# Altium project PCB3.PrjPCB
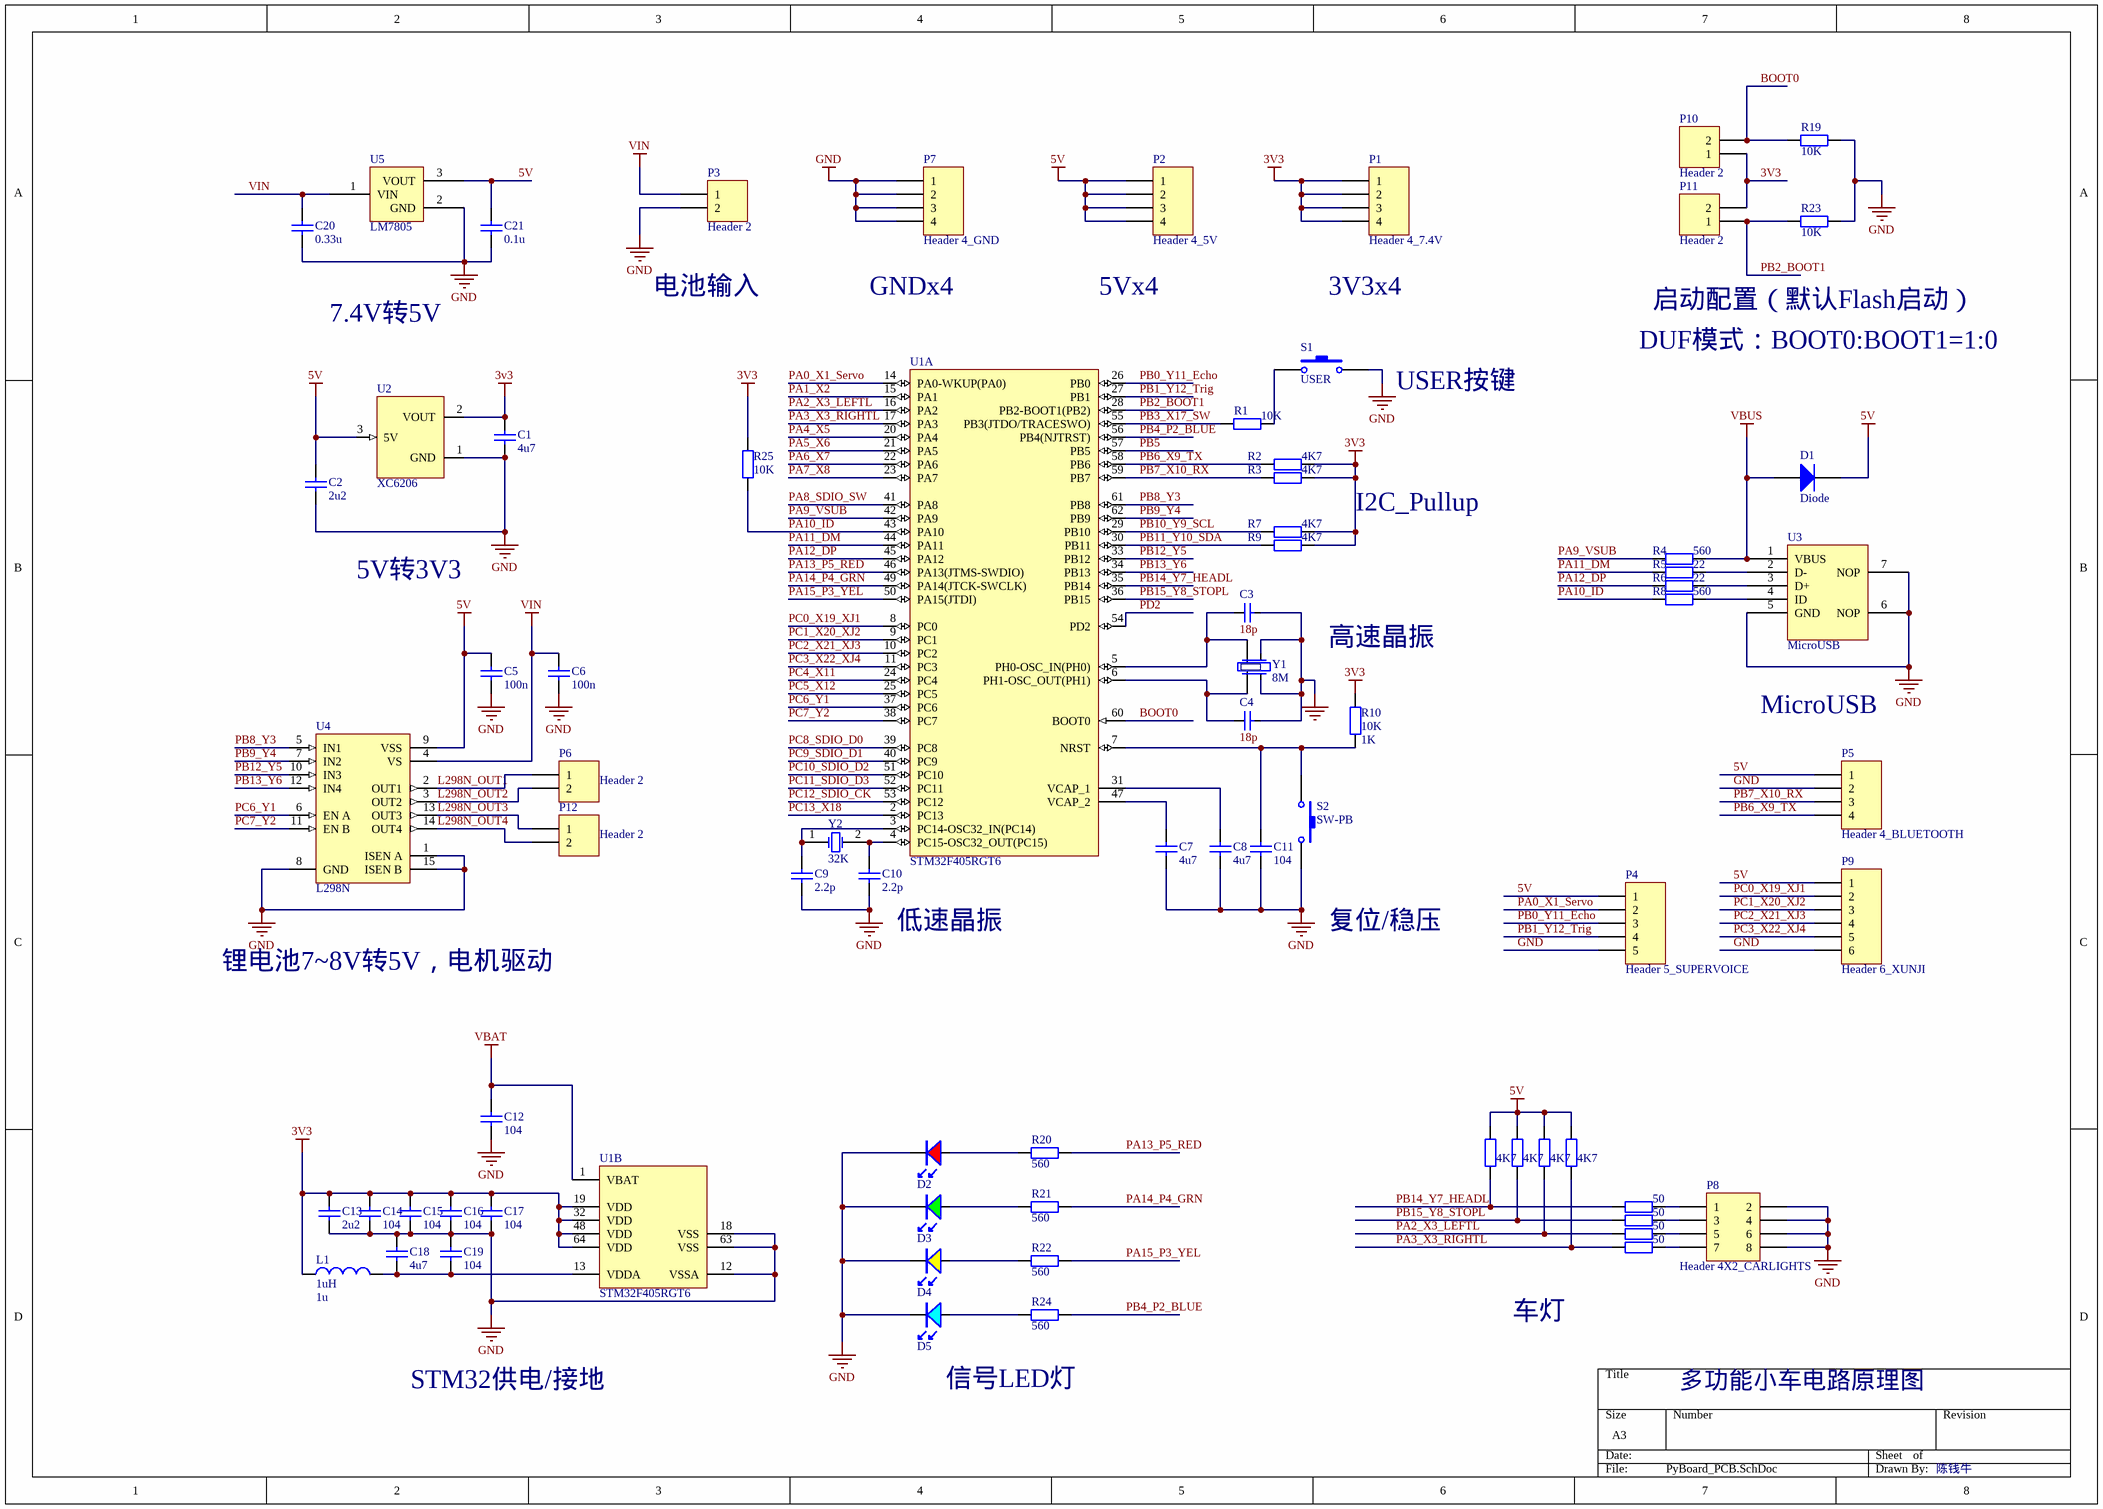
[diagram p0: PyBoard_PCB.SchDoc]
1 sheet, 73 parts. Net scope: global (net labels, ports and power ports of the same name join across sheets).
Board file: PyBoard_PCB.PcbDoc

## Sheet PyBoard_PCB.SchDoc
size A3; PageSetup: Record=PageOptions|CenterHorizontal=True|CenterVertical=True|PrintScale=1.00|XCorrection=1.00|YCorrection=1.00|PrintKind=0|BorderSize=5000000|LeftOffset=0|BottomOffset=0|Orientation=2|PaperLength=1000|PaperWidth=1000|Scale=100|PaperSource=7|PrintQuality=-4|MediaType=1|DitherType=10|PaperKind=A4|PrintScaleMode=1

### Parts
C1  4u7  [SMD0805]
C2  2u2  [SMD0805]
C3  18p  [SMD0805]
C4  18p  [SMD0805]
C5  100n  [SMD0805]
C6  100n  [SMD0805]
C7  4u7  [SMD0805]
C8  4u7  [SMD0805]
C9  2.2p  [SMD0805]
C10  2.2p  [SMD0805]
C11  104  [SMD0805]
C12  104  [SMD0805]
C13  2u2  [SMD0805]
C14  104  [SMD0805]
C15  104  [SMD0805]
C16  104  [SMD0805]
C17  104  [SMD0805]
C18  4u7  [SMD0805]
C19  104  [SMD0805]
C20  0.33u  [SMD0805]
C21  0.1u  [SMD0805]
D1  Diode  [SS24 - small]
D2  LED RED  [LED0603]  (value not drawn)
D3  LED GREEN  [LED0603]  (value not drawn)
D4  LED Yellow  [LED0603]  (value not drawn)
D5  LED Blue  [LED0603]  (value not drawn)
L1  1uH  value 1u  [SMD0603]
P1  Header 4_7.4V  [HDR1X4]
P2  Header 4_5V  [HDR1X4]
P3  Header 2  [HDR1X2]
P4  Header 5_SUPERVOICE  [HDR1X5]
P5  Header 4_BLUETOOTH  [HDR1X4]
P6  Header 2  [HDR1X2]
P7  Header 4_GND  [HDR1X4]
P8  Header 4X2_CARLIGHTS  [HDR2X4]
P9  Header 6_XUNJI  [HDR1X6]
P10  Header 2  [HDR1X2]
P11  Header 2  [HDR1X2]
P12  Header 2  [HDR1X2]
R1  10K  [SMD0805]
R2  4K7  [SMD0805]
R3  4K7  [SMD0805]
R4  560  [SMD0805]
R5  22  [SMD0805]
R6  22  [SMD0805]
R7  4K7  [SMD0805]
R8  560  [SMD0805]
R9  4K7  [SMD0805]
R10  10K  value 1K  [SMD0805]
R11  4K7  [SMD0805]
R12  4K7  [SMD0805]
R13  4K7  [SMD0805]
R14  4K7  [SMD0805]
R15  50  [SMD0805]
R16  50  [SMD0805]
R17  50  [SMD0805]
R18  50  [SMD0805]
R19  10K  [SMD0805]
R20  560  [SMD0805]
R21  560  [SMD0805]
R22  560  [SMD0805]
R23  10K  [SMD0805]
R24  560  [SMD0805]
R25  10K  [SMD0805]
S1  USER  [SW 3X6]
S2  SW-PB  [SW 3X6]
U1  STM32F405RGT6  [LQFP64_M]  (parts A,B of 2)
U2  XC6206  [SOT-23_N]
U3  MicroUSB  [MicroUSB]
U4  L298N  [Multiwatt15V]
U5  LM7805  [TO-220AB]
Y1  8M  [SMD5032]
Y2  32K  [TXC_9H03200019]

### Nets
3V3: C1.2 C13.2 C14.2 C15.2 C16.2 C17.2 L1.1 P1.1 P1.2 P1.3 P1.4 P10.1 P11.2 R2.1 R3.1 R7.1 R9.1 R10.2 R25.2 U1.19(VDD) U1.32(VDD) U1.48(VDD) U1.64(VDD) U2.2(VOUT)
5V: C2.2 C5.2 C21.2 D1.2(K) P2.1 P2.2 P2.3 P2.4 P4.1 P5.1 P9.1 R11.1 R12.1 R13.1 R14.1 U2.3(5V) U4.9(VSS) U5.3(VOUT)
GND: C1.1 C2.1 C3.1 C4.1 C5.1 C6.1 C7.1 C8.1 C9.1 C10.1 C11.1 C12.1 C13.1 C14.1 C15.1 C16.1 C17.1 C18.2 C19.2 C20.1 C21.1 D2.2 D3.2 D4.2 D5.2 P3.2 P4.5 P5.2 P7.1 P7.2 P7.3 P7.4 P8.2 P8.4 P8.6 P8.8 P9.6 R19.2 R23.2 S1.2 S2.2 U1.12(VSSA) U1.18(VSS) U1.63(VSS) U2.1(GND) U3.5(GND) U3.6(NOP) U3.7(NOP) U4.1(ISEN_A) U4.8(GND) U4.15(ISEN_B) U5.2(GND) Y1.2(GND) Y1.4(GND)
VBAT: C12.2 U1.1(VBAT)
VBUS: D1.1(A) R4.2 U3.1(VBUS)
VIN: C6.2 C20.2 P3.1 U4.4(VS) U5.1(VIN)
BOOT0: P10.2 R19.1 U1.60(BOOT0)
L298N_OUT1: P6.1 U4.2(OUT1)
L298N_OUT2: P6.2 U4.3(OUT2)
L298N_OUT3: P12.1 U4.13(OUT3)
L298N_OUT4: P12.2 U4.14(OUT4)
PA0_X1_Servo: P4.2 U1.14(PA0-WKUP(PA0))
PA1_X2: U1.15(PA1)
PA2_X3_LEFTL: R13.2 R17.1 U1.16(PA2)
PA3_X3_RIGHTL: R14.2 R18.1 U1.17(PA3)
PA4_X5: U1.20(PA4)
PA5_X6: U1.21(PA5)
PA6_X7: U1.22(PA6)
PA7_X8: U1.23(PA7)
PA8_SDIO_SW: U1.41(PA8)
PA9_VSUB: R4.1 U1.42(PA9)
PA10_ID: R8.1 R25.1 U1.43(PA10)
PA11_DM: R5.1 U1.44(PA11)
PA12_DP: R6.1 U1.45(PA12)
PA13_P5_RED: R20.2 U1.46(PA13(JTMS-SWDIO))
PA14_P4_GRN: R21.2 U1.49(PA14(JTCK-SWCLK))
PA15_P3_YEL: R22.2 U1.50(PA15(JTDI))
PB0_Y11_Echo: P4.3 U1.26(PB0)
PB1_Y12_Trig: P4.4 U1.27(PB1)
PB2_BOOT1: P11.1 R23.1 U1.28(PB2-BOOT1(PB2))
PB3_X17_SW: R1.2 U1.55(PB3(JTDO/TRACESWO))
PB4_P2_BLUE: R24.2 U1.56(PB4(NJTRST))
PB5: U1.57(PB5)
PB6_X9_TX: P5.4 R2.2 U1.58(PB6)
PB7_X10_RX: P5.3 R3.2 U1.59(PB7)
PB8_Y3: U1.61(PB8) U4.5(IN1)
PB9_Y4: U1.62(PB9) U4.7(IN2)
PB10_Y9_SCL: R7.2 U1.29(PB10)
PB11_Y10_SDA: R9.2 U1.30(PB11)
PB12_Y5: U1.33(PB12) U4.10(IN3)
PB13_Y6: U1.34(PB13) U4.12(IN4)
PB14_Y7_HEADL: R11.2 R15.1 U1.35(PB14)
PB15_Y8_STOPL: R12.2 R16.1 U1.36(PB15)
PC0_X19_XJ1: P9.2 U1.8(PC0)
PC1_X20_XJ2: P9.3 U1.9(PC1)
PC2_X21_XJ3: P9.4 U1.10(PC2)
PC3_X22_XJ4: P9.5 U1.11(PC3)
PC4_X11: U1.24(PC4)
PC5_X12: U1.25(PC5)
PC6_Y1: U1.37(PC6) U4.6(EN_A)
PC7_Y2: U1.38(PC7) U4.11(EN_B)
PC8_SDIO_D0: U1.39(PC8)
PC9_SDIO_D1: U1.40(PC9)
PC10_SDIO_D2: U1.51(PC10)
PC11_SDIO_D3: U1.52(PC11)
PC12_SDIO_CK: U1.53(PC12)
PC13_X18: U1.2(PC13)
PD2: U1.54(PD2)
NetC3_2: C3.2 U1.5(PH0-OSC_IN(PH0)) Y1.3(OSC2)
NetC4_2: C4.2 U1.6(PH1-OSC_OUT(PH1)) Y1.1(OSC1)
NetC7_2: C7.2 U1.47(VCAP_2)
NetC8_2: C8.2 U1.31(VCAP_1)
NetC9_2: C9.2 U1.3(PC14-OSC32_IN(PC14)) Y2.1(OSC1)
NetC10_2: C10.2 U1.4(PC15-OSC32_OUT(PC15)) Y2.2(OSC2)
NetC11_2: C11.2 R10.1 S2.1 U1.7(NRST)
NetC18_1: C18.1 C19.1 L1.2 U1.13(VDDA)
NetD2_1: D2.1 R20.1
NetD3_1: D3.1 R21.1
NetD4_1: D4.1 R22.1
NetD5_1: D5.1 R24.1
NetP8_1: P8.1 R15.2
NetP8_3: P8.3 R16.2
NetP8_5: P8.5 R17.2
NetP8_7: P8.7 R18.2
NetR1_1: R1.1 S1.1
NetR5_2: R5.2 U3.2(D-)
NetR6_2: R6.2 U3.3(D+)
NetR8_2: R8.2 U3.4(ID)

### Notes on the sheet
- 电池输入
- GNDx4
- 5Vx4
- 3V3x4
- 启动配置（默认Flash启动）
- 7.4V转5V
- DUF模式：BOOT0:BOOT1=1:0
- USER按键
- I2C_Pullup
- 5V转3V3
- 高速晶振
- MicroUSB
- 锂电池7~8V转5V，电机驱动
- (near C10) 低速晶振
- 复位/稳压
- 车灯
- STM32供电/接地
- 信号LED灯
- 多功能小车电路原理图
- 陈钱牛

### Library data of the parts
C1 C5 C6 C20 C21 = Cap: Capacitor; Value: 2u2; Published: 8-Jun-2000; LatestRevisionDate: 17-Jul-2002; LatestRevisionNote: Re-released for DXP Platform.; PackageReference: RAD-0.3; Publisher: Altium Limited
C2 C7-C19 = Cap: Capacitor; Published: 8-Jun-2000; LatestRevisionDate: 17-Jul-2002; LatestRevisionNote: Re-released for DXP Platform.; PackageReference: RAD-0.3; Publisher: Altium Limited
  C2: Value: 2u2
C3 C4 = Cap
D1 = Diode: Default Diode; Published: 8-Jun-2000; LatestRevisionDate: 17-Jul-2002; LatestRevisionNote: Re-released for DXP Platform.; PackageDocument: Sep-1996; PackageReference: SMC; Publisher: Altium Limited; Code_JEDEC: DO-214-AB
D2 = LED-RED: 红色发光二极管
D3 = LED-GREEN: 绿色发光二极管
D4 = LED-YELLOW: 黄色发光二极管
D5 = LED-BLUE: 蓝色发光二极管
L1 = Inductor: Code_IEC: 1005; Published: 8-Jun-2000; LatestRevisionDate: 17-Jul-2002; LatestRevisionNote: Re-released for DXP Platform.; PackageReference: 0402-A; Publisher: Altium Limited; Code_JEITA: 0402
P1 P2 P5 P7 = Header 4: Header, 4-Pin; LatestRevisionDate: 17-Jul-2002; LatestRevisionNote: Re-released for DXP Platform.; Publisher: Altium Limited
P3 P6 P10-P12 = Header 2: Header, 2-Pin; LatestRevisionDate: 17-Jul-2002; LatestRevisionNote: Re-released for DXP Platform.; Publisher: Altium Limited
P4 = Header 5: Header, 5-Pin; LatestRevisionDate: 17-Jul-2002; LatestRevisionNote: Re-released for DXP Platform.; Publisher: Altium Limited
P8 = Header 4X2: Header, 4-Pin, Dual row; LatestRevisionDate: 17-Jul-2002; LatestRevisionNote: Re-released for DXP Platform.; Publisher: Altium Limited
P9 = Header 6: Header, 6-Pin; LatestRevisionDate: 17-Jul-2002; LatestRevisionNote: Re-released for DXP Platform.; Publisher: Altium Limited
R1-R18 R20-R22 R24 = Res: Resistor; Published: 8-Jun-2000; LatestRevisionDate: 17-Jul-2002; LatestRevisionNote: Re-released for DXP Platform.; PackageReference: AXIAL-0.4; Publisher: Altium Limited
  R4 R8 R20-R22 R24: Value: 560
  R5 R6: Value: 22
R19 R23 R25 = Res: Resistor; Value: 560; Published: 8-Jun-2000; LatestRevisionDate: 17-Jul-2002; LatestRevisionNote: Re-released for DXP Platform.; PackageReference: AXIAL-0.4; Publisher: Altium Limited
S1 S2 = SW-PB: Switch; Published: 24-Mar-1999; LatestRevisionDate: 17-Jul-2002; LatestRevisionNote: Re-released for DXP Platform.; PackageReference: SPST-2; Publisher: Altium Limited
U1 = STM32F405RGT6: ARM Cortex-M4 32-bit MCU+FPU, 210 DMIPS, 1024 kB Flash, 192 kB Internal RAM, 51 I/Os, 64-pin LQFP, -40 to 85 degC, Tray; Manufacturer: STMicroelectronics; D/A Converter: 2x12-bit; FLASH Size (Prog) (kB): 1024; I/Os (High Current): 51; Internal RAM Size (kB): 192; Operating Frequency(F) (Processor speed) (MHz): 168; Supply Voltage(Vcc) max (V): 3.6; Supply Voltage(Vcc) min (V): 1.8; DatasheetVersion: Rev. 4; PackageVersion: Rev. 4, 06/2013; PackageReference: LQFP64; PackageDescription: 64-Pin Low Profile Quad Flat Package, 10 x 10 mm Body, 0.5 mm Pitch; Supplier 1: Digi-Key; Supplier Part Number 1: 497-11767-ND; Supplier 2: Farnell; Supplier Part Number 2: 2064363; Supplier 3: Newark; Supplier Part Number 3: 73T2329; Supplier 4: Mouser; Supplier Part Number 4: 511-STM32F405RGT6; Core: ARM Cortex-M4; Packing: Tray; Mounting Technology: Surface Mount; PartNumber: STM32F405RGT6; ComponentLink1Description: Manufacturer URL; ComponentLink1URL: http://www.st.com/web/en/home.html; ComponentLink2Description: Datasheet; ComponentLink2URL: http://www.st.com/st-web-ui/static/active/en/resource/technical/document/datasheet/DM00037051.pdf; ComponentLink3Description: Package Specification; ComponentLink3URL: http://www.st.com/st-web-ui/static/active/en/resource/technical/document/datasheet/DM00037051.pdf
U4 = L298N: Dual Full Bridge Driver; Published: 8-Jun-2000; LatestRevisionDate: 14-May-2007; LatestRevisionNote: Mapped to vertical PCB.; DatasheetVersion: Jul-1999; PackageReference: Multiwatt15V; Publisher: Altium Limited; PackageDescription: TO, Thru-Hole, Vertical, Heatsink Mounted; 15 Bent Staggered Leads; Pitch 1.27 mm; ComponentLink1Description: Manufacturer Link; ComponentLink1URL: http://www.st.com/; ComponentLink2Description: Datasheet; ComponentLink2URL: http://www.st.com/stonline/products/literature/ds/1773/l298.pdf
Y1 = XTAL_SMD: SMD5032 8M 4Pin有源晶振
Y2 = XTAL: Crystal Oscillator; Published: 8-Jun-2000; LatestRevisionDate: 17-Jul-2002; LatestRevisionNote: Re-released for DXP Platform.; PackageReference: R38; Publisher: Altium Limited